# Altium schematic sheet RWcircuit_1.SchDoc
size A4
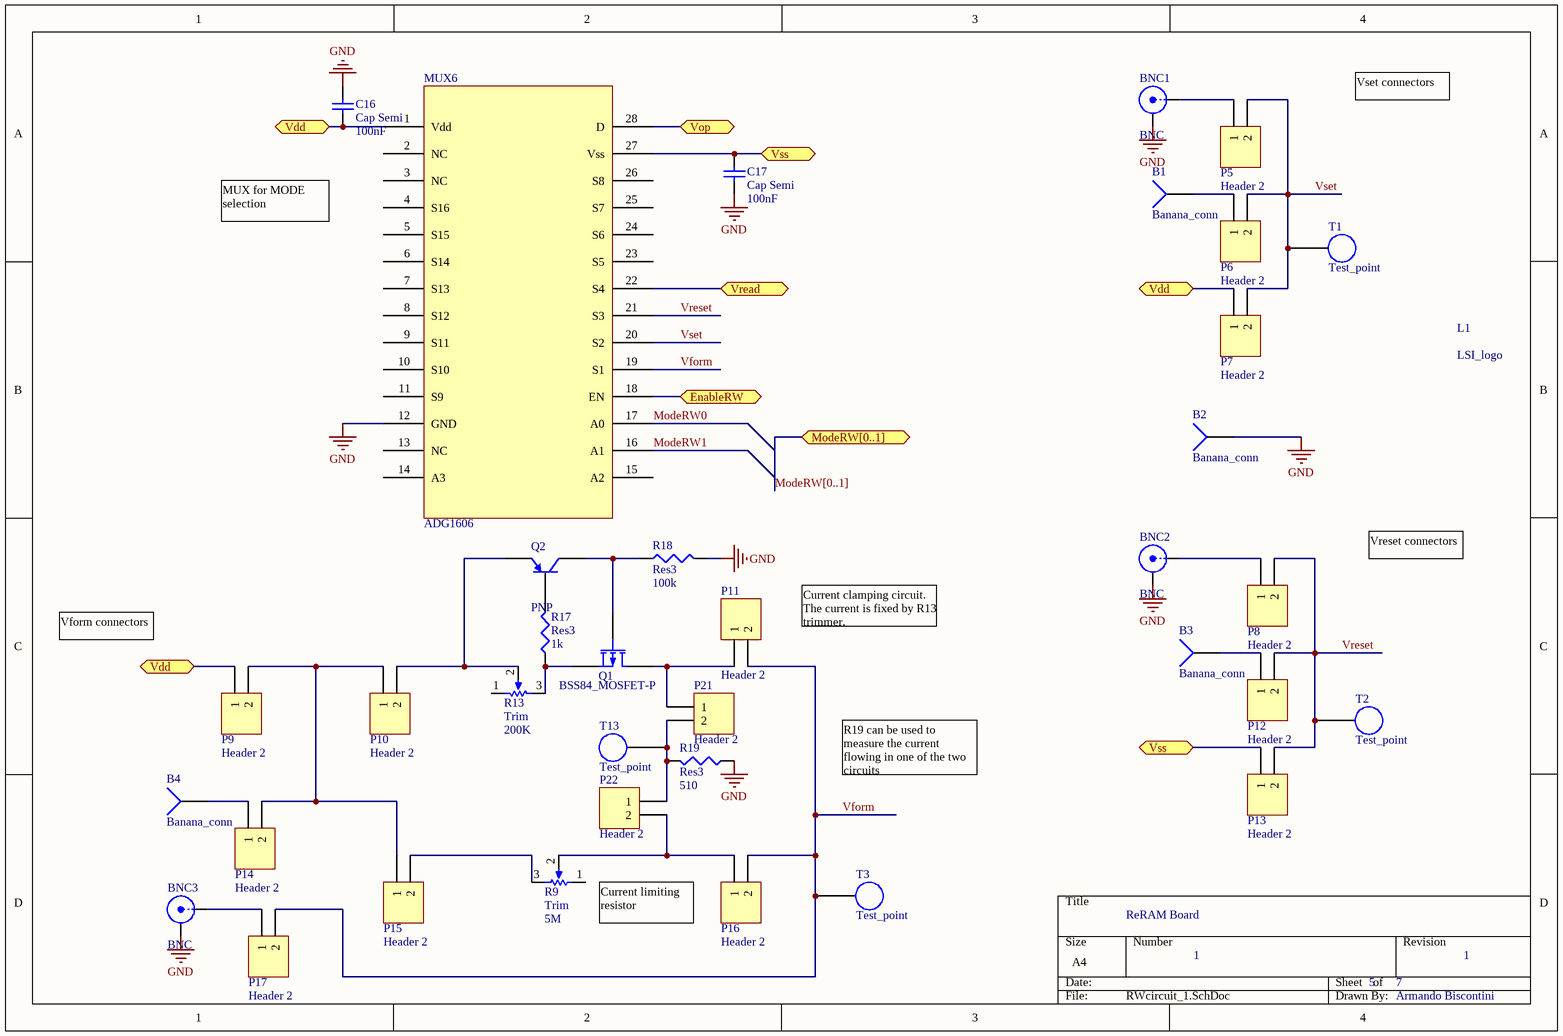
[diagram p0: RWcircuit_1.SchDoc]

## Parts
B1  Banana_conn  [Banana_conn_4mm]
B2  Banana_conn  [Banana_conn_4mm]
B3  Banana_conn  [Banana_conn_4mm]
B4  Banana_conn  [Banana_conn_4mm]
BNC1  BNC  [BNC_RA CON]
BNC2  BNC  [BNC_RA CON]
BNC3  BNC  [BNC_RA CON]
C16  Cap Semi  value 100nF  [C1206]
C17  Cap Semi  value 100nF  [C1206]
L1  LSI_logo  [LSI_logo]
MUX6  ADG1606  [TSOP65P640X120-28N]
P5  Header 2  [HDR1X2]
P6  Header 2  [HDR1X2]
P7  Header 2  [HDR1X2]
P8  Header 2  [HDR1X2]
P9  Header 2  [HDR1X2]
P10  Header 2  [HDR1X2]
P11  Header 2  [HDR1X2]
P12  Header 2  [HDR1X2]
P13  Header 2  [HDR1X2]
P14  Header 2  [HDR1X2]
P15  Header 2  [HDR1X2]
P16  Header 2  [HDR1X2]
P17  Header 2  [HDR1X2]
P21  Header 2  [HDR1X2]
P22  Header 2  [HDR1X2]
Q1  BSS84_MOSFET-P  [BSS84_MOSFET-P]
Q2  PNP  [MMBT5087_PNP]
R9  Trim  value 5M  [Trim_Bourns_3266X]
R13  Trim  value 200K  [Trim_Bourns_3266W]
R17  Res3  value 1k  [J1-0603]
R18  Res3  value 100k  [J1-0603]
R19  Res3  value 510  [J1-0603]
T1  Test_point  [Test_point_1.32mm]
T2  Test_point  [Test_point_1.32mm]
T3  Test_point  [Test_point_1.32mm]
T13  Test_point  [Test_point_1.32mm]

## Ports
EnableRW, ModeRW[0..1], Vdd, Vop, Vread, Vss

## Nets
GND: B2.1 BNC1.2(Y) BNC2.2(Y) BNC3.2(Y) C16.2 C17.1 MUX6.12(GND) R18.2 R19.1
EnableRW: MUX6.18(EN) ; port EnableRW
ModeRW0: MUX6.17(A0)
ModeRW1: MUX6.16(A1)
Vdd: C16.1 MUX6.1(Vdd) P7.1 P9.1 ; port Vdd
Vform: MUX6.19(S1) P11.2 P16.2 P17.2 T3.1
Vop: MUX6.28(D) ; port Vop
Vread: MUX6.22(S4) ; port Vread
Vreset: MUX6.21(S3) P8.2 P12.2 P13.2 T2.1
Vset: MUX6.20(S2) P5.2 P6.2 P7.2 T1.1
Vss: C17.2 MUX6.27(Vss) P13.1 ; port Vss
NetB1_1: B1.1 P6.1
NetB3_1: B3.1 P12.1
NetB4_1: B4.1 P14.1
NetBNC1_1: BNC1.1(X) P5.1
NetBNC2_1: BNC2.1(X) P8.1
NetBNC3_1: BNC3.1(X) P17.1
NetP9_2: P9.2 P10.1 P14.2 P15.1
NetP10_2: P10.2 Q2.3(E) R13.2(TAP)
NetP11_1: P11.1 P21.1 Q1.3(D)
NetP15_2: P15.2 R9.3(BOT)
NetP16_1: P16.1 P22.2 R9.2(TAP)
NetP21_2: P21.2 P22.1 R19.2 T13.1
NetQ1_1: Q1.1(G) Q2.1(C) R18.1
NetQ1_2: Q1.2(S) R13.3(BOT) R17.1
NetQ2_2: Q2.2(B) R17.2

Not connected (* = marked no-connect by the designer): MUX6 2(NC) 3(NC) 4(S16) 5(S15) 6(S14) 7(S13) 8(S12) 9(S11) 10(S10) 11(S9) 13(NC) 14(A3) 15(A2) 23(S5) 24(S6) 25(S7) 26(S8); R9 1(TOP); R13 1(TOP)

## Buses and harness runs
bus ModeRW[0..1] = port ModeRW[0..1]

## Notes on the sheet
- Vset connectors
- MUX for MODE selection
- Vreset connectors
- Vform connectors
- Current clamping circuit.
  The current is fixed by R13 trimmer.
- R19 can be used to measure the current flowing in one of the two circuits
- Current limiting resistor
- ReRAM Board
- 1
- 5
- 7
- Armando Biscontini

## Library data of the parts
B1-B4 = Banana_conn_4mm: Multicomp banana connector 4mm pcb through hole
BNC1-BNC3 = BNC: BNC Elbow Connector; LatestRevisionDate: 17-Jul-2002; LatestRevisionNote: Re-released for DXP Platform.; Publisher: Altium Limited
C16 C17 = Cap Semi: Capacitor (Semiconductor SIM Model); Published: 8-Jun-2000; LatestRevisionDate: 29-May-2009; LatestRevisionNote: IPC-7351 Footprint Added.; PackageReference: C1206; Publisher: Altium Limited; PackageDescription: Chip Capacitor
L1 = LSI_logo: LSI logo
MUX6 = ADG1606: Analog Devices ADG1606
P5-P17 P21 P22 = Header 2: Header, 2-Pin; LatestRevisionDate: 17-Jul-2002; LatestRevisionNote: Re-released for DXP Platform.; Publisher: Altium Limited
Q1 = BSS84_MOSFET-P: BSS84 P-Channel MOSFET; Published: 8-Jun-2000; LatestRevisionDate: 17-Jul-2002; LatestRevisionNote: Re-released for DXP Platform.; PackageVersion: 1995/1996; PackageReference: E3; Publisher: Altium Limited; PackageDescription: TO, Flat Index; 3 In-Line, Axial Leads; Body Dia. 4.6mm; Lead Dia. 0.5 mm (max)
Q2 = MMBT5087_PNP: MMBT5087 PNP Bipolar Transistor; Published: 8-Jun-2000; LatestRevisionDate: 29-May-2009; LatestRevisionNote: IPC-7351 Footprint Added.; PackageVersion: Aug-1999; PackageReference: SOT-23B; Publisher: Altium Limited; PackageDescription: 3-Pin SOT-23 Package 0.95 mm Pitch, 2.4 mm Lead Span
R9 = Trim_Bourns_3266X: Trimmer Bourns 3266X; Sim Note: Enter the Resistance value and the set point into parameter fields.; Set Position: 0.5; Published: 8-Jun-2000; LatestRevisionDate: 17-Jul-2002; LatestRevisionNote: Re-released for DXP Platform.; PackageReference: VR5; Publisher: Altium Limited; PackageDescription: Variable Resistor, Thru-Hole; 3 Leads
R13 = Trim_Bourns_3266W: Trimmer Bourns 3266W; Sim Note: Enter the Resistance value and the set point into parameter fields.; Set Position: 0.5; Published: 8-Jun-2000; LatestRevisionDate: 17-Jul-2002; LatestRevisionNote: Re-released for DXP Platform.; PackageReference: VR5; Publisher: Altium Limited; PackageDescription: Variable Resistor, Thru-Hole; 3 Leads
R17-R19 = Res3: Resistor; Published: 8-Jun-2000; LatestRevisionDate: 29-May-2009; LatestRevisionNote: IPC-7351 Footprint Added.; PackageReference: J1-0603; Publisher: Altium Limited; PackageDescription: Chip Resistor
T1-T3 T13 = Test_point_1.32mm: Test point 1.32mm